# Altium schematic sheet TopLevel.SchDoc
size Tabloid; DrawnBy: V-P.Rheaume@USherbrooke.ca; Organization: Universite de Sherbrooke; Address1: L3, 12a Rodborough Rd; Address2: Frenchs Forest; Address3: NSW; Address4: Australia 2086; Revision: 0; SheetNumber: 1; SheetTotal: 8; SheetName: Block diagram
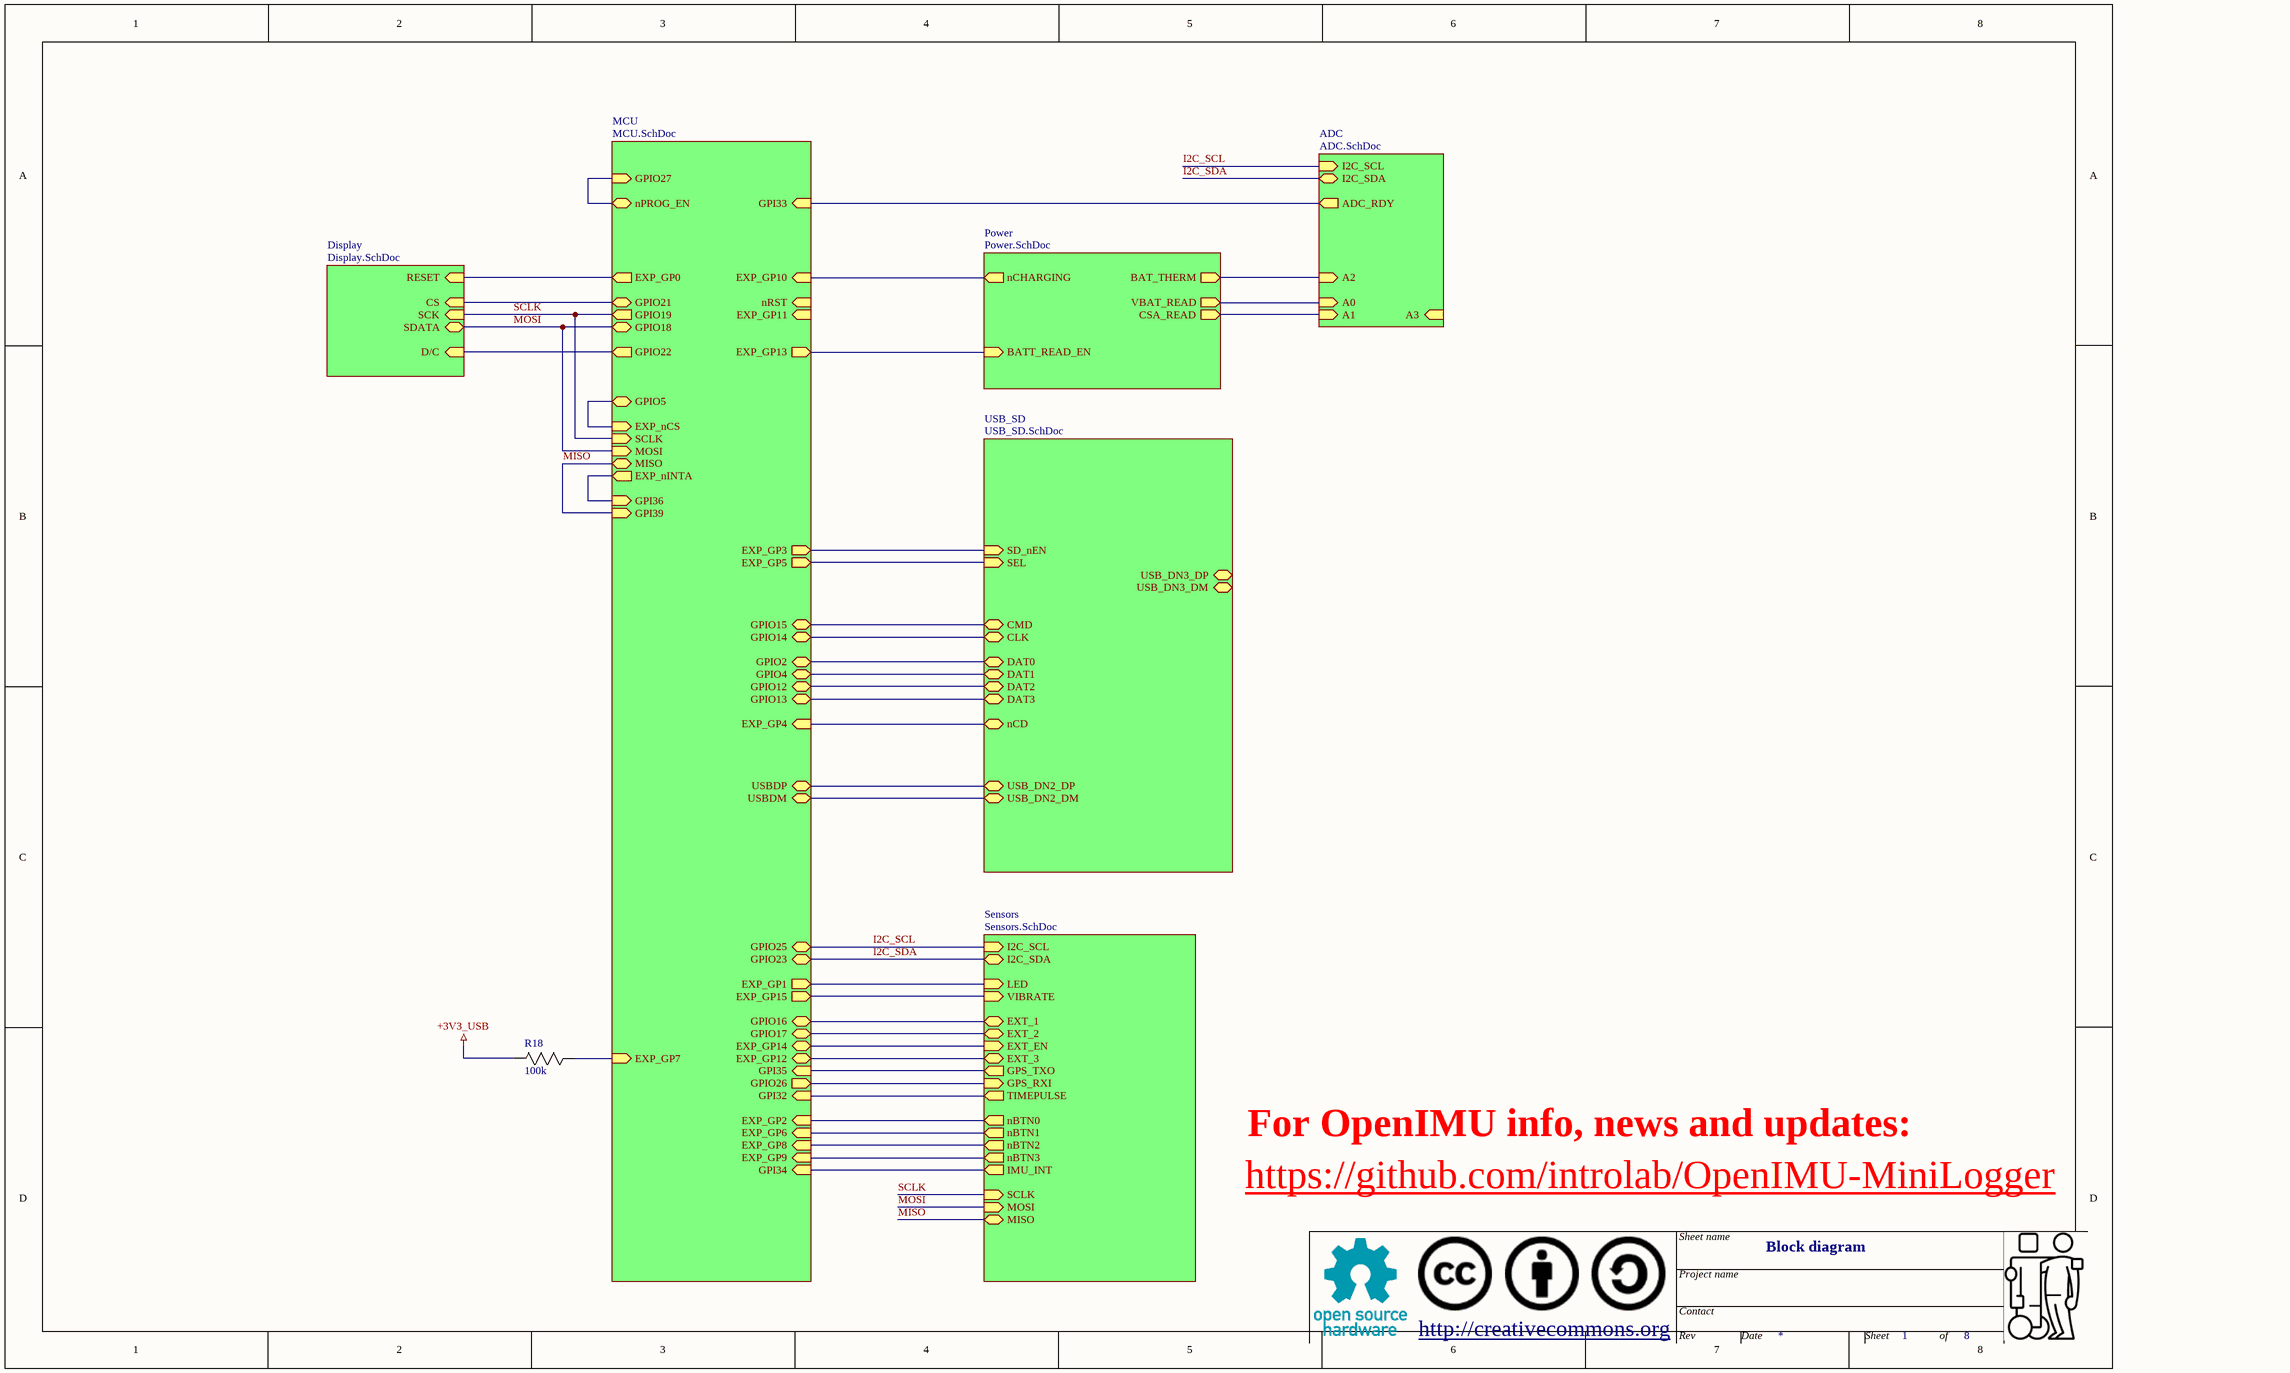
[diagram p0: TopLevel.SchDoc]

## Parts
R18  value 100k  [0402]  (hidden comment: Resistor)

## Sub-sheets
ADC = ADC.SchDoc: A2 (in), A3 (in), A1 (in), A0 (in), I2C_SCL (in), ADC_RDY (out), I2C_SDA (bidir)
Display = Display.SchDoc: SDATA (bidir), CS (in), RESET (in), SCK (in), D/C (in)
MCU = MCU.SchDoc: GPIO14 (bidir), GPIO13 (bidir), GPIO4 (bidir), USBDP (bidir), GPIO12 (bidir), USBDM (bidir), GPIO15 (bidir), GPIO2 (bidir), EXP_GP7 (in), EXP_GP3 (out), EXP_GP2 (in), EXP_GP1 (out), EXP_GP0 (out), EXP_GP6 (in), EXP_GP5 (out), EXP_GP4 (in), EXP_GP11 (in), EXP_GP9 (in), EXP_GP14 (bidir), EXP_GP8 (in), EXP_GP13 (out), EXP_GP15 (out), EXP_GP12 (bidir), EXP_GP10 (in), GPIO5 (bidir), GPIO16 (bidir), GPIO17 (bidir), GPIO18 (bidir), GPIO19 (out), GPIO22 (out), GPIO21 (bidir), GPI35 (in), GPIO27 (in), GPIO26 (out), GPIO23 (bidir), GPIO25 (bidir), nRST (in), GPI39 (in), GPI36 (in), GPI34 (in), MOSI (in), EXP_nCS (in), MISO (bidir), SCLK (in), EXP_nINTA (out), GPI33 (in), GPI32 (in), nPROG_EN (bidir)
Power = Power.SchDoc: CSA_READ (out), VBAT_READ (out), BATT_READ_EN (in), BAT_THERM (out), nCHARGING (out)
Sensors = Sensors.SchDoc: TIMEPULSE (out), LED (in), nBTN2 (out), VIBRATE (in), nBTN1 (out), IMU_INT (out), I2C_SDA (bidir), I2C_SCL (in), GPS_RXI (in), GPS_TXO (out), EXT_1 (bidir), EXT_2 (bidir), EXT_EN (in), nBTN3 (out), nBTN0 (out), MISO (bidir), MOSI (in), EXT_3 (bidir), SCLK (in)
USB_SD = USB_SD.SchDoc: SEL (in), CMD (bidir), CLK (bidir), DAT1 (bidir), nCD (bidir), DAT2 (bidir), DAT0 (bidir), USB_DN3_DP (bidir), USB_DN3_DM (bidir), DAT3 (bidir), USB_DN2_DM (bidir), USB_DN2_DP (bidir), SD_nEN (in)

## Nets
+3V3_USB: R18.2
I2C_SCL: sheet MCU/GPIO25, sheet Sensors/I2C_SCL, sheet ADC/I2C_SCL
I2C_SDA: sheet MCU/GPIO23, sheet Sensors/I2C_SDA, sheet ADC/I2C_SDA
MISO: sheet MCU/GPI39, sheet MCU/MISO, sheet Sensors/MISO
MOSI: sheet MCU/GPIO18, sheet MCU/MOSI, sheet Sensors/MOSI, sheet Display/SDATA
SCLK: sheet MCU/GPIO19, sheet MCU/SCLK, sheet Sensors/SCLK, sheet Display/SCK
NetR18_1: R18.1 ; sheet MCU/EXP_GP7
(unnamed): sheet USB_SD/SEL, sheet MCU/EXP_GP5
(unnamed): sheet USB_SD/CMD, sheet MCU/GPIO15
(unnamed): sheet USB_SD/CLK, sheet MCU/GPIO14
(unnamed): sheet USB_SD/DAT1, sheet MCU/GPIO4
(unnamed): sheet USB_SD/nCD, sheet MCU/EXP_GP4
(unnamed): sheet USB_SD/DAT2, sheet MCU/GPIO12
(unnamed): sheet USB_SD/DAT0, sheet MCU/GPIO2
(unnamed): sheet USB_SD/DAT3, sheet MCU/GPIO13
(unnamed): sheet USB_SD/USB_DN2_DM, sheet MCU/USBDM
(unnamed): sheet USB_SD/USB_DN2_DP, sheet MCU/USBDP
(unnamed): sheet USB_SD/SD_nEN, sheet MCU/EXP_GP3
(unnamed): sheet MCU/EXP_GP2, sheet Sensors/nBTN0
(unnamed): sheet MCU/EXP_GP1, sheet Sensors/LED
(unnamed): sheet MCU/EXP_GP0, sheet Display/RESET
(unnamed): sheet MCU/EXP_GP6, sheet Sensors/nBTN1
(unnamed): sheet MCU/EXP_GP9, sheet Sensors/nBTN3
(unnamed): sheet MCU/EXP_GP14, sheet Sensors/EXT_EN
(unnamed): sheet MCU/EXP_GP8, sheet Sensors/nBTN2
(unnamed): sheet MCU/EXP_GP13, sheet Power/BATT_READ_EN
(unnamed): sheet MCU/EXP_GP15, sheet Sensors/VIBRATE
(unnamed): sheet MCU/EXP_GP12, sheet Sensors/EXT_3
(unnamed): sheet MCU/EXP_GP10, sheet Power/nCHARGING
(unnamed): sheet MCU/GPIO5, sheet MCU/EXP_nCS
(unnamed): sheet MCU/GPIO16, sheet Sensors/EXT_1
(unnamed): sheet MCU/GPIO17, sheet Sensors/EXT_2
(unnamed): sheet MCU/GPIO22, sheet Display/D/C
(unnamed): sheet MCU/GPIO21, sheet Display/CS
(unnamed): sheet MCU/GPI35, sheet Sensors/GPS_TXO
(unnamed): sheet MCU/GPIO27, sheet MCU/nPROG_EN
(unnamed): sheet MCU/GPIO26, sheet Sensors/GPS_RXI
(unnamed): sheet MCU/GPI36, sheet MCU/EXP_nINTA
(unnamed): sheet MCU/GPI34, sheet Sensors/IMU_INT
(unnamed): sheet MCU/GPI33, sheet ADC/ADC_RDY
(unnamed): sheet MCU/GPI32, sheet Sensors/TIMEPULSE
(unnamed): sheet Power/CSA_READ, sheet ADC/A1
(unnamed): sheet Power/VBAT_READ, sheet ADC/A0
(unnamed): sheet Power/BAT_THERM, sheet ADC/A2

## Notes on the sheet
- For OpenIMU info, news and updates:
- https://github.com/introlab/OpenIMU-MiniLogger
- Sheet name
- http://creativecommons.org
- Project name
- Contact
- Rev
- Date
- Sheet
- of

## Library data of the parts
R18 = Resistor: Mfg: Yageo; Mfg_PN: RC0402JR-07100KL; HelpURL: *; NI: *; Supplier1: Digikey; Supplier1_PN: 311-100KJRCT-ND; Type: *; Rating: *; Tolerance: *